# EAGLE design mote+cc3200 (EAGLE 9.6.2)

## Sheet 1 of 2
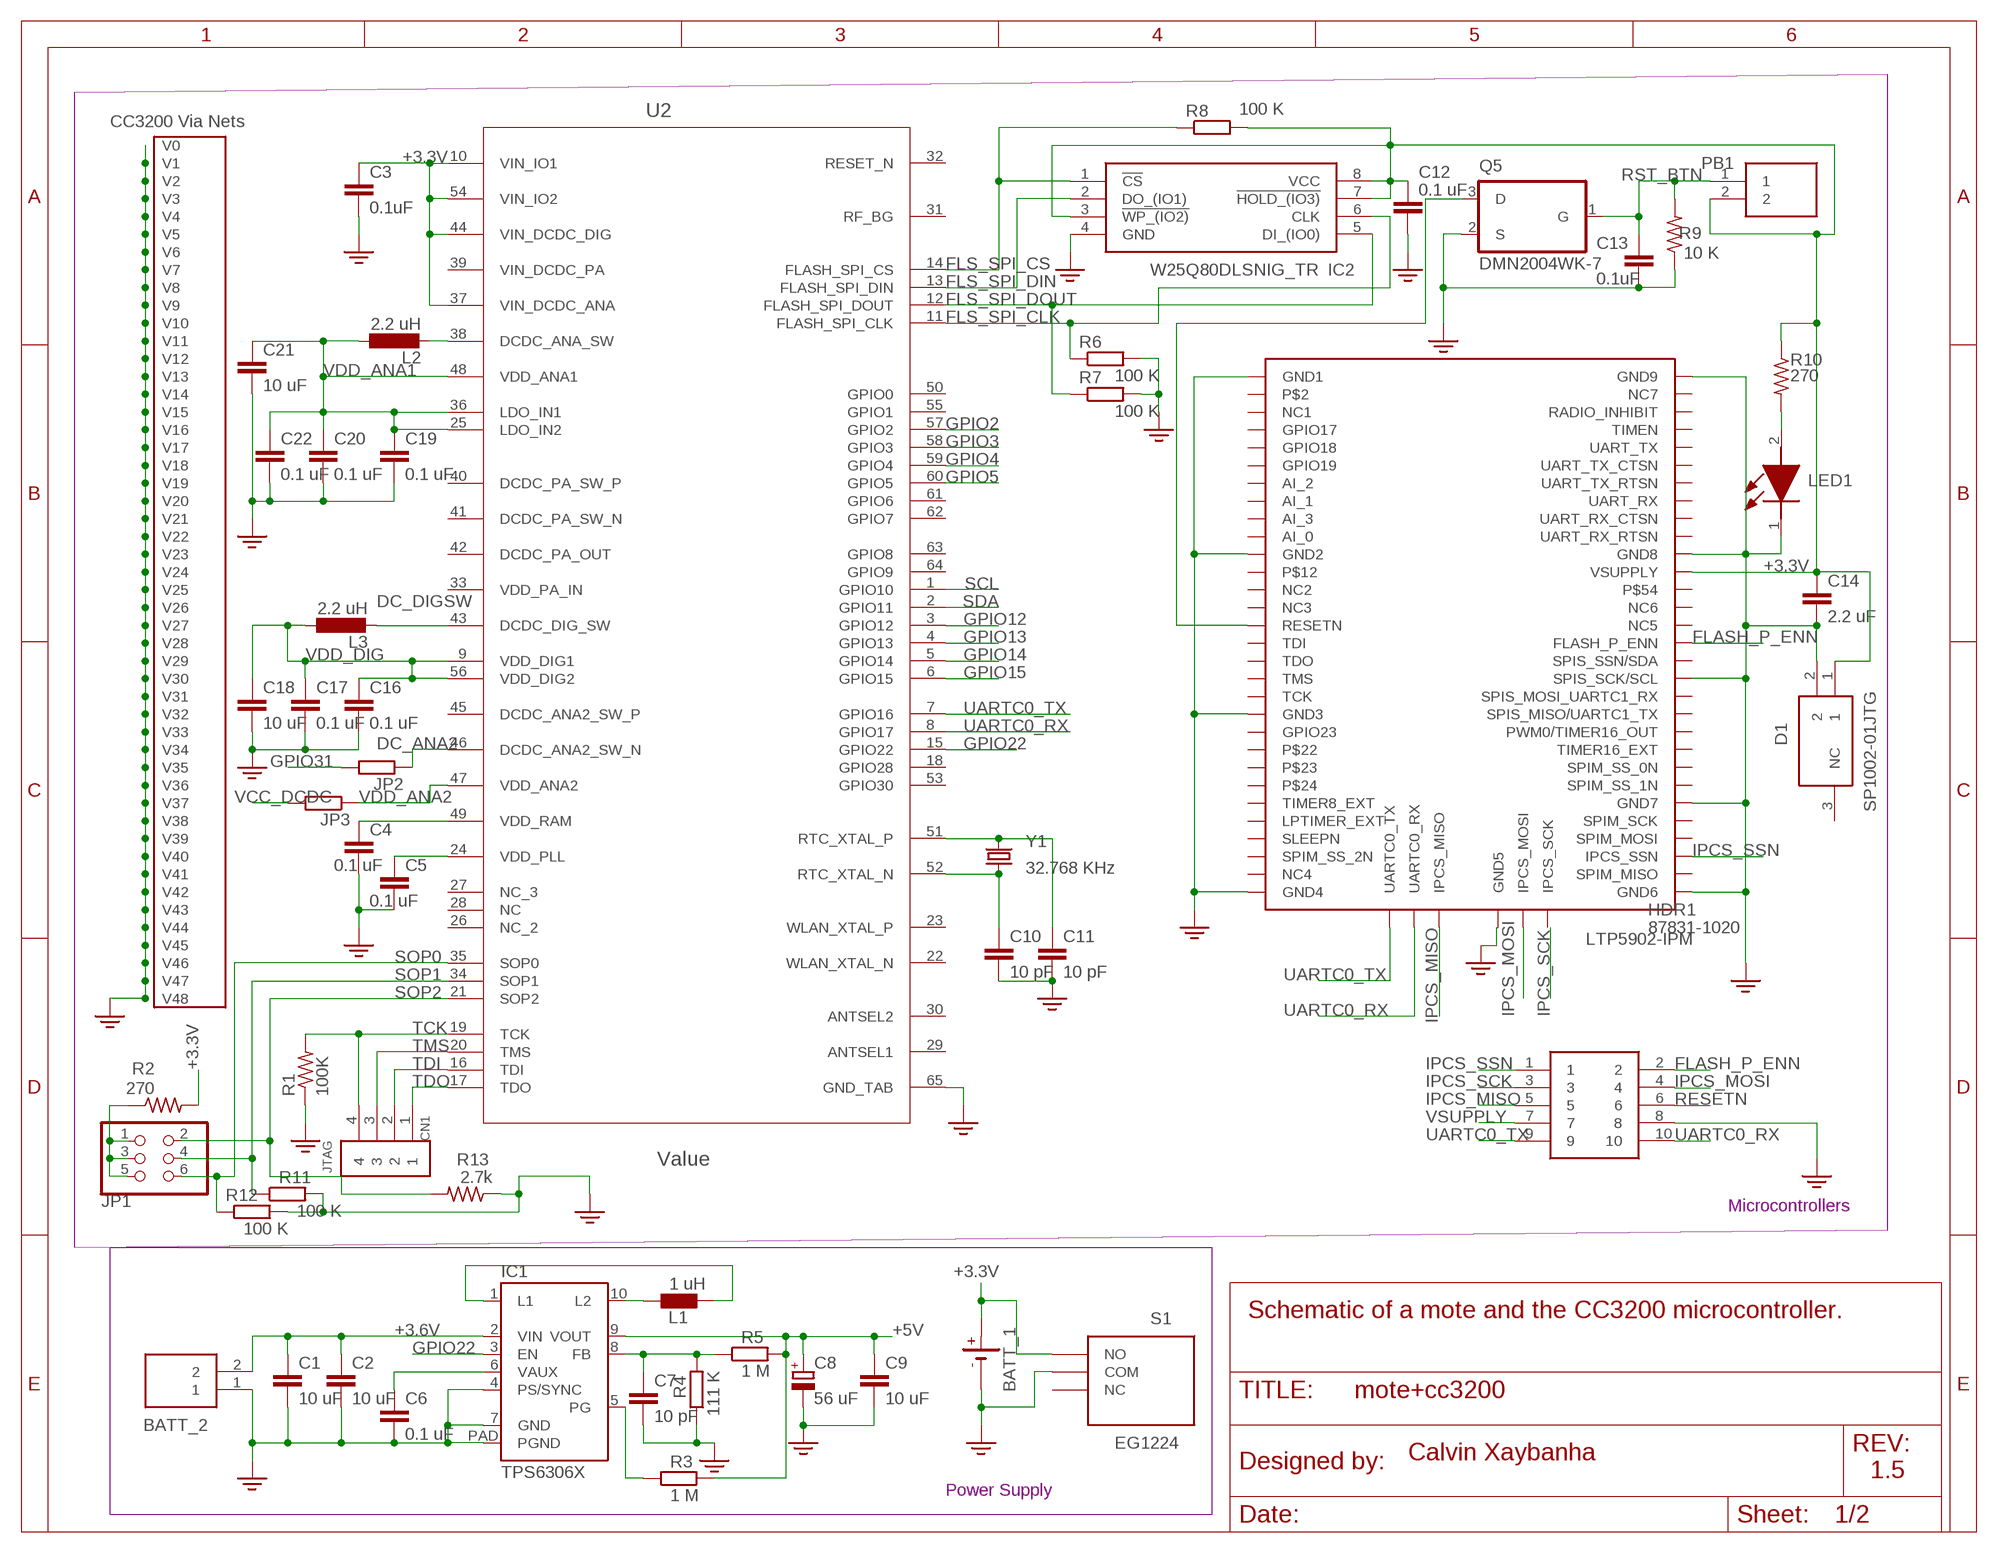
[diagram p0: schematic, sheet 1]
FRAME1 (FRAME_8.5X11): SPICEPREFIX: X

### Parts
BATT_1  BATTERY_BR1225/FA  [BATTERY_BR1225/FA]
BATT_2  12BH23P-GR  [12BH23PGR]
C1  10 uF  CC1808  [C1808]
C2  10 uF  CC1808  [C1808]
C3  0.1uF  C5/3.5  [C5B3.5]
C4  0.1 uF  C-EUC1808  [C1808]
C5  0.1 uF  C-EUC1808  [C1808]
C6  0.1 uF  C-EUC1808  [C1808]
C7  10 pF  CC1808  [C1808]
C8  56 uF  CPOL-EUE3.5-8  [E3,5-8]
C9  10 uF  CC1808  [C1808]
C10  10 pF  CC1808  [C1808]
C11  10 pF  CC1808  [C1808]
C12  0.1 uF  C-EUC1808  [C1808]
C13  0.1uF  C5/3.5  [C5B3.5]
C14  2.2 uF  CC1808  [C1808]
C16  0.1 uF  C-EUC1808  [C1808]
C17  0.1 uF  C-EUC1808  [C1808]
C18  10 uF  CC1808  [C1808]
C19  0.1 uF  C-EUC1808  [C1808]
C20  0.1 uF  C-EUC1808  [C1808]
C21  10 uF  CC1808  [C1808]
C22  0.1 uF  C-EUC1808  [C1808]
CN1  JTAG  1X4-BIG  [1X04-BIG]
D1  SP1002-01JTG  [SOT132P220X110-3N]
HDR1  87831-1020  [SHDR10W55P200_2X5_1265X630X640]
IC1  TPS6306X  [S-PWSON-N10]
IC2  W25Q80DLSNIG_TR  [SOIC127P600X175-8N]
JP1  PINHD-2X3/90  [2X03/90]
JP2  RR0201  [R0201]
JP3  RR0201  [R0201]
L1  1 uH  L0204/7  [0204/7]
L2  2.2 uH  L-EUL3216C  [L3216C]
L3  2.2 uH  L-EUL3216C  [L3216C]
LED1  156120RS75000  [LEDM3216X130N]
PB1  FSMSM  [FSMSM]
Q5  DMN2004WK-7  [SC70-3_DCK]
R1  100K  R-US_0207/10  [0207/10]
R2  270  WSLP1206R0500FEA  [RES_1206]
R3  1 M  R-EU_R5025  [R5025]
R4  111 K  R-EU_R1206  [R1206]
R5  1 M  R-EU_R5025  [R5025]
R6  100 K  R-EU_R1206  [R1206]
R7  100 K  R-EU_R1206  [R1206]
R8  100 K  R-EU_R1206  [R1206]
R9  10 K  WSLP1206R0500FEA  [RES_1206]
R10  270  WSLP1206R0500FEA  [RES_1206]
R11  100 K  R-EU_R1206  [R1206]
R12  100 K  R-EU_R1206  [R1206]
R13  2.7k  WSLP1206R0500FEA  [RES_1206]
S1  EG1224  [EG1224]
U2  Value  CC3200R1M2RGCR  [RGC0064A]
U3  LTP5902  [LTP5902-MMCX]
Y1  32.768 KHz  KX-13  [7.0X5.0]

### Nets
+3.3V [Power]: BATT_1.+ C3.1 C12.1 C14.1 D1.1 IC2.3(!WP_(IO2)) IC2.7(!HOLD_(IO3)) IC2.8(VCC) PB1.2 R2.2 R8.2 R10.1 S1.1(NO) U2.10(VIN_IO1) U2.37(VIN_DCDC_ANA) U2.44(VIN_DCDC_DIG) U2.54(VIN_IO2) U3.P55(VSUPPLY) ; also sheet 2
+3.6V [Power]: BATT_2.2 C1.1 C2.1 IC1.2(VIN)
+5V [Power]: C8.+ C9.1 IC1.9(VOUT) R3.2 R5.2 ; also sheet 2
DC_ANA2 [Signals]: JP2.1 U2.46(DCDC_ANA2_SW_N)
DC_DIGSW [Signals]: L3.2 U2.43(DCDC_DIG_SW)
FB_TPS [Signals]: C7.1 IC1.8(FB) R4.2 R5.1
FLASH_P_ENN [Signals]: HDR1.2 U3.P51(FLASH_P_ENN)
FLS_SPI_CLK [Signals]: IC2.6(CLK) R6.1 U2.11(FLASH_SPI_CLK)
FLS_SPI_CS [Signals]: IC2.1(!CS) R8.1 U2.14(FLASH_SPI_CS)
FLS_SPI_DIN [Signals]: IC2.2(DO_(IO1)) U2.13(FLASH_SPI_DIN)
FLS_SPI_DOUT [Signals]: IC2.5(DI_(IO0)) R7.1 U2.12(FLASH_SPI_DOUT)
GND: BATT_1.- BATT_2.1 C1.2 C2.2 C3.2 C4.2 C5.2 C6.2 C7.2 C8.- C9.2 C10.2 C11.2 C12.2 C13.1 C14.2 C16.2 C17.2 C18.2 C19.2 C20.2 C21.2 C22.2 D1.2 HDR1.8 IC1.4(PS/SYNC) IC1.7(GND) IC1.PAD(PGND) IC2.4(GND) LED1.1(K) Q5.2(S) R1.1 R4.1 R6.2 R7.2 R9.1 R11.2 R12.2 R13.1 S1.2(COM) U2.65(GND_TAB) U2.V(V0) U2.V_1(V1) U2.V_2(V2) U2.V_3(V3) U2.V_4(V4) U2.V_5(V5) U2.V_6(V6) U2.V_7(V7) U2.V_8(V8) U2.V_9(V9) U2.V_10(V10) U2.V_11(V11) U2.V_12(V12) U2.V_13(V13) U2.V_14(V14) U2.V_15(V15) U2.V_16(V16) U2.V_17(V17) U2.V_18(V18) U2.V_19(V19) U2.V_20(V20) U2.V_21(V21) U2.V_22(V22) U2.V_23(V23) U2.V_24(V24) U2.V_25(V25) U2.V_26(V26) U2.V_27(V27) U2.V_28(V28) U2.V_29(V29) U2.V_30(V30) U2.V_31(V31) U2.V_32(V32) U2.V_33(V33) U2.V_34(V34) U2.V_35(V35) U2.V_36(V36) U2.V_37(V37) U2.V_38(V38) U2.V_39(V39) U2.V_40(V40) U2.V_41(V41) U2.V_42(V42) U2.V_43(V43) U2.V_44(V44) U2.V_45(V45) U2.V_46(V46) U2.V_47(V47) U2.V_48(V48) U3.P1(GND1) U3.P11(GND2) U3.P20(GND3) U3.P30(GND4) U3.P34(GND5) U3.P37(GND6) U3.P42(GND7) U3.P49(SPIS_SCK/SCL) U3.P56(GND8) U3.P66(GND9) ; supply symbol labelled GND2 ; also sheet 2
GPIO2 [Signals]: U2.57(GPIO2) ; also sheet 2
GPIO3 [Signals]: U2.58(GPIO3) ; also sheet 2
GPIO4 [Signals]: U2.59(GPIO4) ; also sheet 2
GPIO5 [Signals]: U2.60(GPIO5) ; also sheet 2
GPIO12 [Signals]: U2.3(GPIO12) ; also sheet 2
GPIO13 [Signals]: U2.4(GPIO13) ; also sheet 2
GPIO14 [Signals]: U2.5(GPIO14) ; also sheet 2
GPIO15 [Signals]: U2.6(GPIO15) ; also sheet 2
GPIO22 [Signals]: IC1.3(EN) U2.15(GPIO22)
GPIO31 [Signals]: JP2.2
IPCS_MISO [Signals]: HDR1.5 U3.P33(IPCS_MISO)
IPCS_MOSI [Signals]: U3.P35(IPCS_MOSI)
IPCS_SCK [Signals]: HDR1.3
IPCS_SSN [Signals]: HDR1.1 U3.P39(IPCS_SSN)
JP1_PWR: JP1.1 JP1.3 JP1.5 R2.1
L2_ANA [Signals]: L2.2 U2.38(DCDC_ANA_SW)
L_TPS1 [Signals]: IC1.1(L1) L1.2
L_TPS2 [Signals]: IC1.10(L2) L1.1
LED1 [Signals]: LED1.2(A) R10.2
PG_TPS [Signals]: IC1.5(PG) R3.1
RESETN [Signals]: HDR1.6 Q5.3(D) U3.P15(RESETN)
RST_BTN [Signals]: C13.2 PB1.1 Q5.1(G) R9.2
SCL [Signals]: U2.1(GPIO10) ; also sheet 2
SDA [Signals]: U2.2(GPIO11) ; also sheet 2
SOP0 [Signals]: JP1.6 R12.1 U2.35(SOP0)
SOP1 [Signals]: JP1.4 R11.1 U2.34(SOP1)
SOP2 [Signals]: JP1.2 R13.2 U2.21(SOP2)
TCK [Signals]: CN1.4 R1.2 U2.19(TCK)
TDI [Signals]: CN1.2 U2.16(TDI)
TDO [Signals]: CN1.1 U2.17(TDO)
TMS [Signals]: CN1.3 U2.20(TMS)
UARTC0_RX [Signals]: HDR1.10 U2.8(GPIO17) U3.P32(UARTC0_RX)
UARTC0_TX [Signals]: HDR1.9 U2.7(GPIO16) U3.P31(UARTC0_TX)
VAUX_TPS [Signals]: C6.1 IC1.6(VAUX)
VCC_DCDC [Signals]: JP3.2
VDD_ANA1 [Signals]: C19.1 C20.1 C21.1 C22.1 L2.1 U2.25(LDO_IN2) U2.36(LDO_IN1) U2.48(VDD_ANA1)
VDD_ANA2 [Signals]: JP3.1 U2.47(VDD_ANA2)
VDD_DIG: C16.1 C17.1 C18.1 L3.1 U2.9(VDD_DIG1) U2.56(VDD_DIG2)
VDD_PULL [Signals]: C5.1 U2.24(VDD_PLL)
VDD_RAM [Signals]: C4.1 U2.49(VDD_RAM)
VSUPPLY: HDR1.7
XTAL1 [Signals]: C11.1 U2.51(RTC_XTAL_P) Y1.3
XTAL2 [Signals]: C10.1 U2.52(RTC_XTAL_N) Y1.1
Unconnected: D1.3(NC) HDR1.4 S1.3(NC) S1.MH1 S1.MH2 S1.MH3 S1.MH4 U2.18(GPIO28) U2.22(WLAN_XTAL_N) U2.23(WLAN_XTAL_P) U2.26(NC_2) U2.27(NC_3) U2.28(NC) U2.29(ANTSEL1) U2.30(ANTSEL2) U2.31(RF_BG) U2.32(RESET_N) U2.45(DCDC_ANA2_SW_P) U2.50(GPIO0) U2.53(GPIO30) U2.55(GPIO1) U2.61(GPIO6) U2.62(GPIO7) U2.63(GPIO8) U2.64(GPIO9) U3.P2 U3.P3(NC1) U3.P4(GPIO17) U3.P5(GPIO18) U3.P6(GPIO19) U3.P7(AI_2) U3.P8(AI_1) U3.P9(AI_3) U3.P10(AI_0) U3.P12 U3.P13(NC2) U3.P14(NC3) U3.P16(TDI) U3.P17(TDO) U3.P18(TMS) U3.P19(TCK) U3.P21(GPIO23) U3.P22 U3.P23 U3.P24 U3.P25(TIMER8_EXT) U3.P26(LPTIMER_EXT) U3.P27(SLEEPN) U3.P28(SPIM_SS_2N) U3.P29(NC4) U3.P36(IPCS_SCK) U3.P38(SPIM_MISO) U3.P40(SPIM_MOSI) U3.P41(SPIM_SCK) U3.P43(SPIM_SS_1N) U3.P44(SPIM_SS_0N) U3.P45(TIMER16_EXT) U3.P46(PWM0/TIMER16_OUT) U3.P47(SPIS_MISO/UARTC1_TX) U3.P48(SPIS_MOSI_UARTC1_RX) U3.P50(SPIS_SSN/SDA) U3.P52(NC5) U3.P53(NC6) U3.P54 U3.P57(UART_RX_RTSN) U3.P58(UART_RX_CTSN) U3.P59(UART_RX) U3.P60(UART_TX_RTSN) U3.P61(UART_TX_CTSN) U3.P62(UART_TX) U3.P63(TIMEN) U3.P64(RADIO_INHIBIT) U3.P65(NC7)

### Notes on the sheet
- CC3200 Via Nets
- LTP5902-IPM
- Microcontrollers
- Schematic of a mote and the CC3200 microcontroller.
- Calvin Xaybanha
- 1.5
- Power Supply

## Sheet 2 of 2
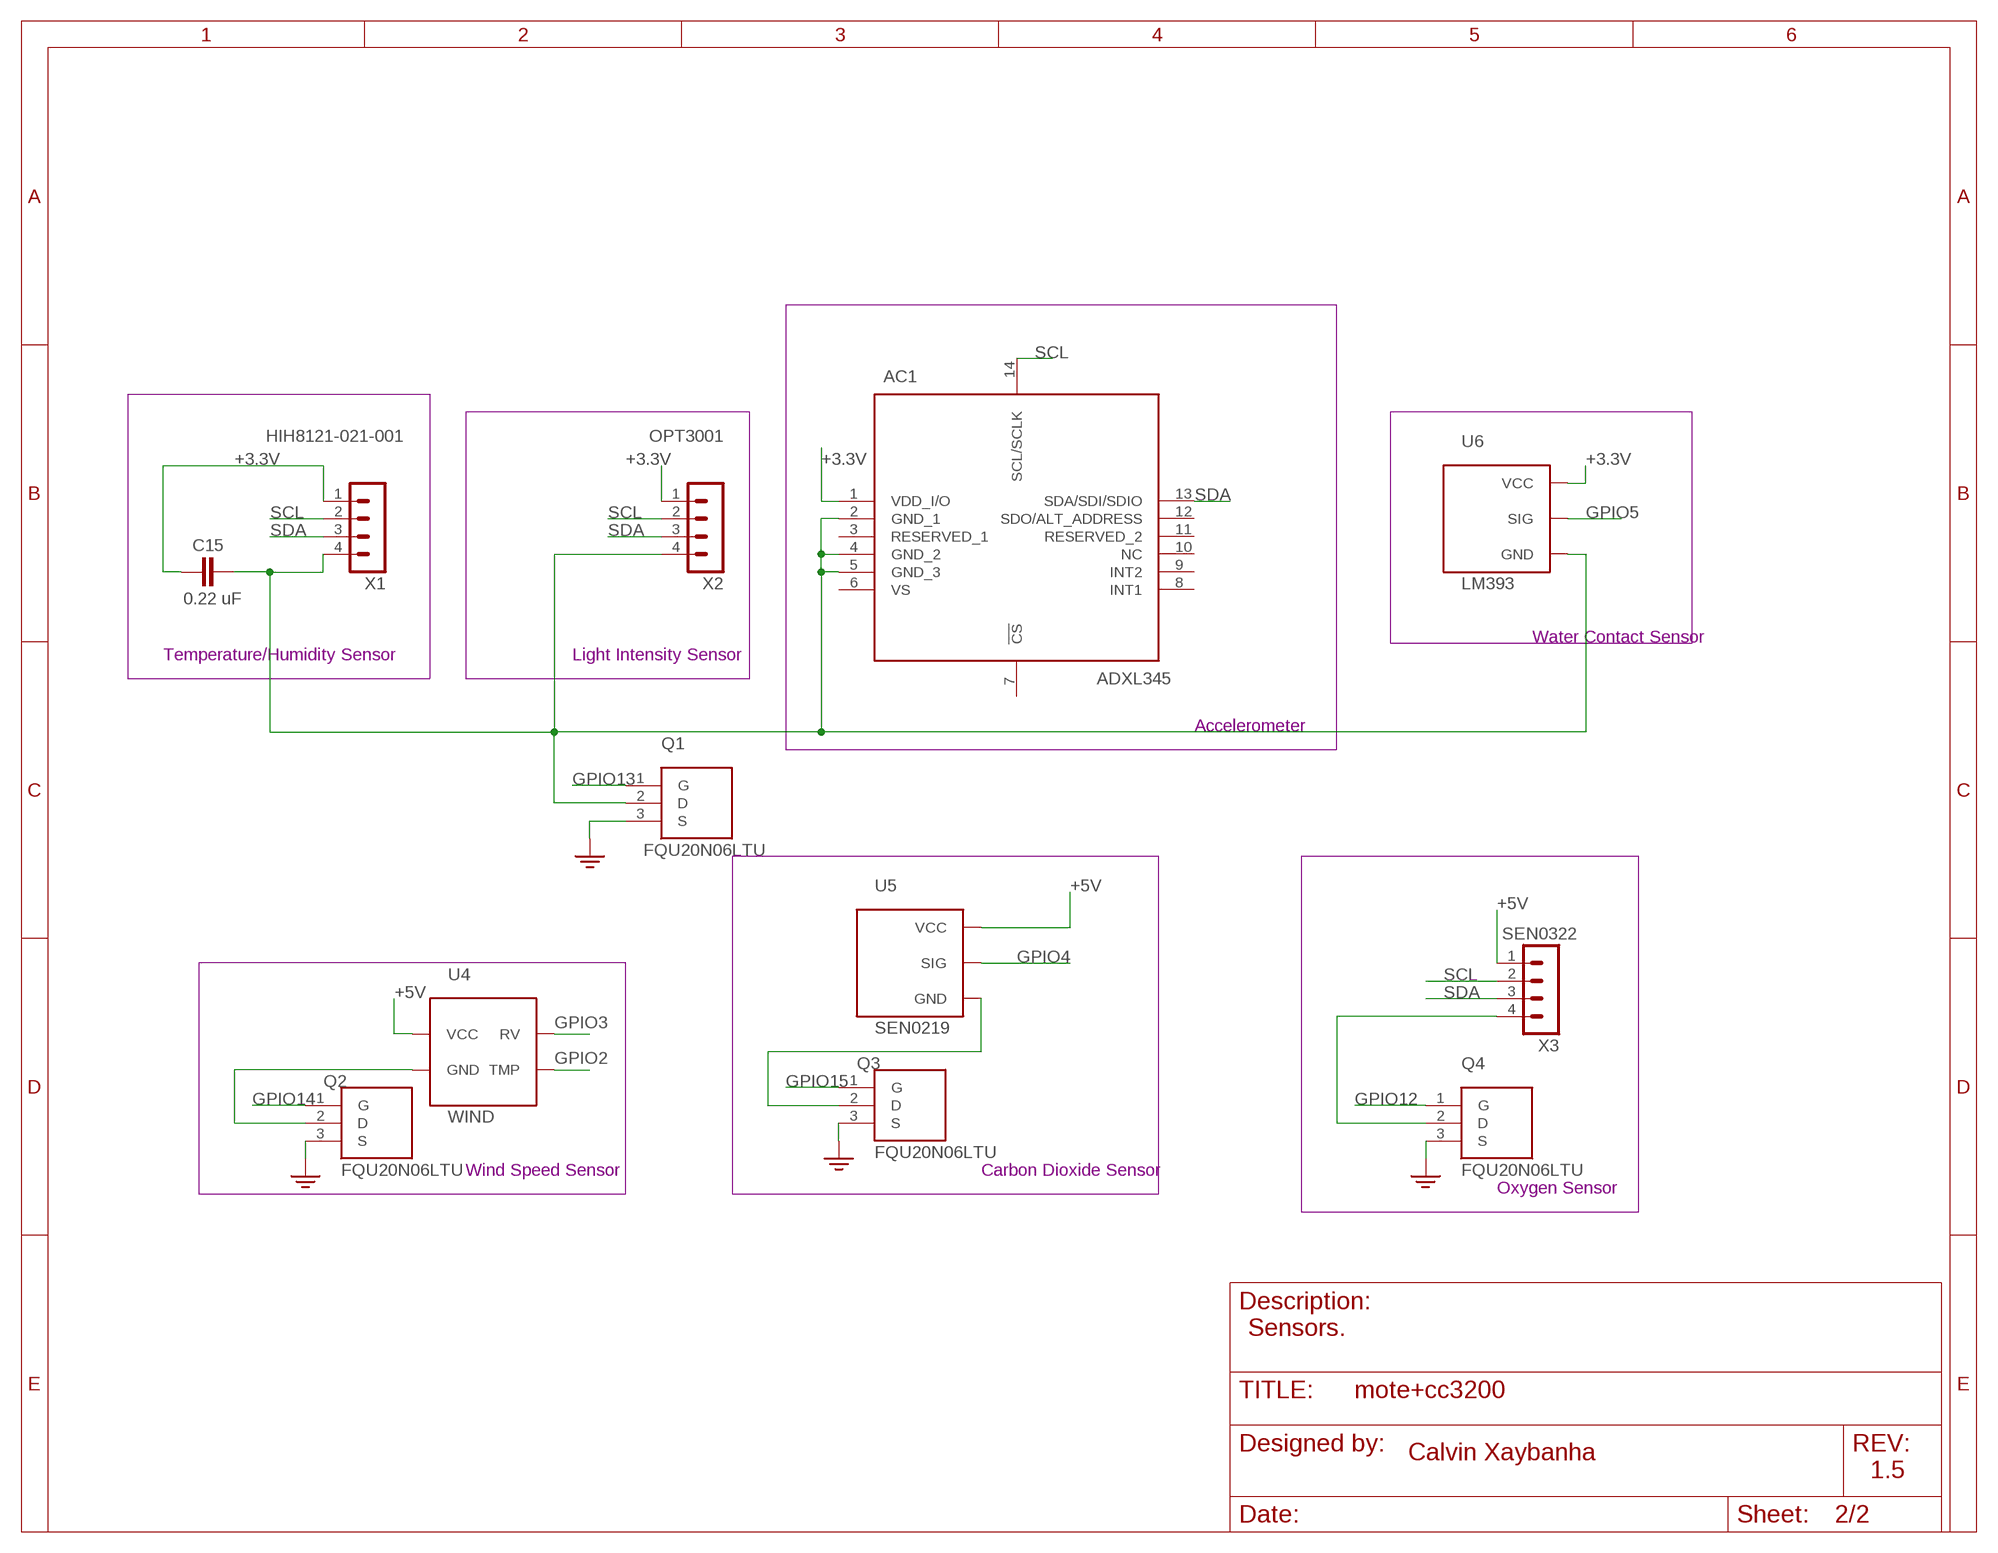
[diagram p1: schematic, sheet 2]

### Parts
AC1  ADXL345  [CC-14-1]
C15  0.22 uF  C5/3.5  [C5B3.5]
Q1  FQU20N06LTU  [TO229P250X658X985-3P]
Q2  FQU20N06LTU  [TO229P250X658X985-3P]
Q3  FQU20N06LTU  [TO229P250X658X985-3P]
Q4  FQU20N06LTU  [TO229P250X658X985-3P]
U4  WIND  [WIND]
U5  SEN0219  [SEN0219]
U6  LM393  [LM393]
X1  HIH8121-021-001  B4B-PH-K-S  [B4B-PH-K-S]
X2  OPT3001  B4B-PH-K-S  [B4B-PH-K-S]
X3  SEN0322  B4B-PH-K-S  [B4B-PH-K-S]

### Nets
+3.3V [Power]: AC1.1(VDD_I/O) C15.1 U6.P$1(VCC) X1.1 X2.1 ; also sheet 1
+5V [Power]: U4.P$1(VCC) U5.P$1(VCC) X3.1 ; also sheet 1
GND: Q1.3(S) Q2.3(S) Q3.3(S) Q4.3(S) ; supply symbol labelled GND2 ; also sheet 1
GPIO2 [Signals]: U4.P$4(TMP) ; also sheet 1
GPIO3 [Signals]: U4.P$3(RV) ; also sheet 1
GPIO4 [Signals]: U5.P$2(SIG) ; also sheet 1
GPIO5 [Signals]: U6.P$2(SIG) ; also sheet 1
GPIO12 [Signals]: Q4.1(G) ; also sheet 1
GPIO13 [Signals]: Q1.1(G) ; also sheet 1
GPIO14 [Signals]: Q2.1(G) ; also sheet 1
GPIO15 [Signals]: Q3.1(G) ; also sheet 1
Q1+ [Signals]: AC1.2(GND_1) AC1.4(GND_2) AC1.5(GND_3) C15.2 Q1.2(D) U6.P$3(GND) X1.4 X2.4
Q2+ [Signals]: Q2.2(D) U4.P$2(GND)
Q3+ [Signals]: Q3.2(D) U5.P$3(GND)
Q4+ [Signals]: Q4.2(D) X3.4
SCL [Signals]: AC1.14(SCL/SCLK) X1.2 X2.2 X3.2 ; also sheet 1
SDA [Signals]: AC1.13(SDA/SDI/SDIO) X1.3 X2.3 X3.3 ; also sheet 1
Unconnected: AC1.3(RESERVED_1) AC1.6(VS) AC1.7(!CS) AC1.8(INT1) AC1.9(INT2) AC1.10(NC) AC1.11(RESERVED_2) AC1.12(SDO/ALT_ADDRESS)

### Notes on the sheet
- Water Contact Sensor
- Temperature/Humidity Sensor | Light Intensity Sensor
- Accelerometer
- Wind Speed Sensor | Carbon Dioxide Sensor
- Oxygen Sensor
- Sensors.
- Calvin Xaybanha
- 1.5

## Power pins joined to a net without a drawn wire
DCDC_PA_OUT: U2.42(DCDC_PA_OUT)
DCDC_PA_SW_N: U2.41(DCDC_PA_SW_N)
DCDC_PA_SW_P: U2.40(DCDC_PA_SW_P)
VDD_PA_IN: U2.33(VDD_PA_IN)
VIN_DCDC_PA: U2.39(VIN_DCDC_PA)

## Library data of the parts
AC1 = ADXL345:ADXL345: 3-Axis Accelerometer IC Source: Datasheet <http://www.analog.com/media/en/technical-documentation/data-sheets/ADXL345.pdf>; DESCRIPTION: 3-Axis Accelerometer IC; HEIGHT: mm; MANUFACTURER_NAME: Analog Devices; MANUFACTURER_PART_NUMBER: ADXL345; MOUSER_PART_NUMBER: N/A; MOUSER_PRICE-STOCK: https://www.mouser.co.uk/ProductDetail/Analog-Devices/ADXL345?qs=5aG0NVq1C4y%252BItyqaAF9pQ%3D%3D
BATT_1 = 52101-101-REV-A_v16:BATTERY_BR1225/FA: BATT LITH COIN 3V
BATT_2 = SamacSys_Parts:12BH23P-GR: Cylindrical Battery Contacts, Clips, Holders & Springs CR123A HOLDER Source: Datasheet <https://www.mouser.co.uk/datasheet/2/209/Eagle_032917_12BH23P-GR_EPD-200981-1171083.pdf>; DESCRIPTION: Cylindrical Battery Contacts, Clips, Holders & Springs CR123A HOLDER; HEIGHT: 15.6mm; MANUFACTURER_NAME: Eagle Plastic Devices; MANUFACTURER_PART_NUMBER: 12BH23P-GR; MOUSER_PART_NUMBER: 12BH23P-GR; MOUSER_PRICE-STOCK: https://www.mouser.co.uk/ProductDetail/Eagle-Plastic-Devices/12BH23P-GR/?qs=AQlKX63v8RtoPEbnxYQ6dg%3D%3D
C1 C2 C7 C9-C11 C14 C18 C21 = eagle-ltspice:C: CAPACITOR, European symbol; SPICEMODEL: NONE; SPICEPREFIX: C
C3 C13 C15 = capacitor-wima:C: CAPACITOR naming: grid - package width
C4-C6 C12 C16 C17 C19 C20 C22 = rcl:C-EU: CAPACITOR, European symbol; SPICEPREFIX: C
C8 = rcl:CPOL-EU: POLARIZED CAPACITOR, European symbol; SPICEPREFIX: C
CN1 = adafruit:1X4: 4-pin connector
D1 = SamacSys_Parts:SP1002-01JTG: Littelfuse SP1002-01JTG, Dual-Element Bi-Directional TVS Diode Array, 3-Pin SC-70 Source: Datasheet <https://www.littelfuse.com/~/media/electronics/datasheets/tvs_diode_arrays/littelfuse_tvs_diode_array_sp1002_datasheet.pdf.pdf>; DESCRIPTION: Littelfuse SP1002-01JTG, Dual-Element Bi-Directional TVS Diode Array, 3-Pin SC-70; HEIGHT: 1.1mm; MANUFACTURER_NAME: LITTELFUSE; MANUFACTURER_PART_NUMBER: SP1002-01JTG; MOUSER_PART_NUMBER: 576-SP1002-01JTG; MOUSER_PRICE-STOCK: https://www.mouser.co.uk/ProductDetail/Littelfuse/SP1002-01JTG?qs=Xb8IjHhkxj6pIS6%252BgvMqKQ%3D%3D
HDR1 = SamacSys_Parts:87831-1020: Header 2.00mm Milli-Grid, vert, TH, 10w Molex MILLI-GRID Series, Series Number 87831, 2mm Pitch 10 Way 2 Row Straight PCB Header, Solder Termination, 2A Source: Datasheet; DESCRIPTION: Header 2.00mm Milli-Grid, vert, TH, 10w Molex MILLI-GRID Series, Series Number 87831, 2mm Pitch 10 Way 2 Row Straight PCB Header, Solder Termination, 2A; HEIGHT: 6.4mm; MANUFACTURER_NAME: Molex; MANUFACTURER_PART_NUMBER: 87831-1020; MOUSER_PART_NUMBER: 538-87831-1020; MOUSER_PRICE-STOCK: https://www.mouser.co.uk/ProductDetail/Molex/87831-1020?qs=8PELaTI4Pt8k%2F%2FV9vKeYIg%3D%3D
IC1 = m_vreg:TPS6306X: TPS6306x High Input Voltage, Buck-Boost Converter With 2-A Switch Current Features Input Voltage Range: 2.5 V to 12 V Efficiency: Up to 93% Output Current at 5 V (VIN<10 V): 2 A in Buck Mode Output Current at 5 V (VIN>4 V): 1.3 A in Boost Mode Automatic Transition Between Step Down and Boost Mode Typical Device Quiescent Current: < 30 μA Fixed and Adjustable Output Voltage Options from 2.5 V to 8 V Power-Save Mode for Improved Efficiency at Low Output Power Forced Fixed-Frequency Operation at 2.4 MHz and Synchronization Possible Power Good Output Buck-Boost Overlap ControlTM Load Disconnect During Shutdown Overtemperature Protection Overvoltage Protection Description The TPS6306x devices provide a power supply solution for products powered by either three-cell up to six-cell alkaline, NiCd or NiMH battery, or a one- cell or dual-cell Li-Ion or Li-polymer battery. Output currents can go as high as 2-A while using a dual-cell Li-Ion or Li-polymer battery, and discharge it down to 5 V or lower. The buck-boost converter is based on a fixed frequency, pulse-width-modulation (PWM) controller using synchronous rectification to obtain maximum efficiency. At low load currents, the converter enters power-save mode to maintain high efficiency over a wide load current range. The power- save mode can be disabled, forcing the converter to operate at a fixed switching frequency. The maximum average current in the switches is limited to a typical value of 2.25 A. The output voltage is programmable using an external resistor divider, or is fixed internally on the chip. The converter can be disabled to minimize battery drain. During shutdown, the load is disconnected from the battery. The devices are available in a 3 mm × 3 mm, 10-pin, WSON (DSC), PowerPADTM package. Information based on TI document SLVSA92B – DECEMBER 2011 – REVISED DECEMBER 2014 Added 2016-07-24; MANUF: TI; PARTNUM: TPS6306X
IC2 = SamacSys_Parts:W25Q80DLSNIG_TR: 2.5V AND 3V 8M-BIT SERIAL FLASH MEMORY WITH DUAL AND QUAD SPI Source: Datasheet <https://www.winbond.com/resource-files/w25q80dv dl_revh_10022015.pdf>; DESCRIPTION: 2.5V AND 3V 8M-BIT SERIAL FLASH MEMORY WITH DUAL AND QUAD SPI; HEIGHT: 1.75mm; MANUFACTURER_NAME: Winbond; MANUFACTURER_PART_NUMBER: W25Q80DLSNIG TR; MOUSER_PART_NUMBER: 454-W25Q80DLSNIGTR; MOUSER_PRICE-STOCK: https://www.mouser.co.uk/ProductDetail/Winbond/W25Q80DLSNIG-TR?qs=qSfuJ%252Bfl%2Fd4EQ3sPamYlCg%3D%3D
JP1 = pinhead:PINHD-2X3: PIN HEADER
JP2 JP3 = eagle-ltspice:R: RESISTOR, European symbol; SPICEMODEL: NONE; SPICEPREFIX: R
L1 = eagle-ltspice:L: INDUCTOR, European symbol; SPICEMODEL: NONE; SPICEPREFIX: L
L2 L3 = rcl:L-EU: INDUCTOR, European symbol; SPICEPREFIX: L
LED1 = SamacSys_Parts:156120RS75000: Wurth Elektronik 156120RS75000, WL-SMRW Series Red LED, 624 nm, 3216 (1206) Clear, Rectangle Lens SMD Package Source: Datasheet <https://katalog.we-online.com/led/datasheet/156120RS75000.pdf>; DESCRIPTION: Wurth Elektronik 156120RS75000, WL-SMRW Series Red LED, 624 nm, 3216 (1206) Clear, Rectangle Lens SMD Package; HEIGHT: 1.3mm; MANUFACTURER_NAME: Wurth Elektronik; MANUFACTURER_PART_NUMBER: 156120RS75000; MOUSER_PART_NUMBER: 710-156120RS75000; MOUSER_PRICE-STOCK: https://www.mouser.co.uk/ProductDetail/Wurth-Elektronik/156120RS75000?qs=2kOmHSv6VfTlw4DhG%252BTIQw%3D%3D
PB1 = SamacSys_Parts:FSMSM: Tactile switch,SMT,SPST,rect black act Black Button Tactile Switch, SPST 50 mA@ 24 V dc 1.07mm Source: Datasheet; DESCRIPTION: Tactile switch,SMT,SPST,rect black act Black Button Tactile Switch, SPST 50 mA@ 24 V dc 1.07mm; HEIGHT: mm; MANUFACTURER_NAME: TE Connectivity; MANUFACTURER_PART_NUMBER: FSMSM; MOUSER_PART_NUMBER: 506-FSMSM; MOUSER_PRICE-STOCK: https://www.mouser.co.uk/ProductDetail/TE-Connectivity-Alcoswitch/FSMSM?qs=UhRTNahLC3yPLf3YjzjKAA%3D%3D
Q1-Q4 = SamacSys_Parts:FQU20N06LTU: Trans MOSFET N-CH 60V 17.2A 3-Pin IPAK Source: Datasheet <https://www.fairchildsemi.com/datasheets/FQ/FQU20N06L.pdf>; DESCRIPTION: Trans MOSFET N-CH 60V 17.2A 3-Pin IPAK; HEIGHT: 2.5mm; MANUFACTURER_NAME: ON Semiconductor; MANUFACTURER_PART_NUMBER: FQU20N06LTU; MOUSER_PART_NUMBER: 512-FQU20N06LTU; MOUSER_PRICE-STOCK: https://www.mouser.co.uk/ProductDetail/ON-Semiconductor-Fairchild/FQU20N06LTU?qs=bfRUmXT2lZisvT2ROxlO3Q%3D%3D
Q5 = SamacSys_Parts:DMN2004WK-7
R1 = resistor:R-US_: RESISTOR, American symbol
R2 R9 R10 R13 = Resistor_Capacitor:WSLP1206R0500FEA: RES 0.05 OHM 1% 1W 1206 Manufacturer's datasheet <http://www.vishay.com/docs/30122/wslp.pdf>; CREATED_BY: PCBLayout.com; DIGIKEY_PART_NUMBER: WSLP-.05TR-ND; MANUFACTURER: Vishay Dale; MPN: WSLP1206R0500FEA; PACKAGE: SMD 1206
R3-R8 R11 R12 = rcl:R-EU_: RESISTOR, European symbol; SPICEPREFIX: R
S1 = SamacSys_Parts:EG1224: E-SWITCH - EG1224 - SWITCH, SLIDE, SPDT, 500mA, 15V, PCB Source: Datasheet; DESCRIPTION: E-SWITCH - EG1224 - SWITCH, SLIDE, SPDT, 500mA, 15V, PCB; HEIGHT: 8.5mm; MANUFACTURER_NAME: E-Switch; MANUFACTURER_PART_NUMBER: EG1224; MOUSER_PART_NUMBER: 612-EG1224; MOUSER_PRICE-STOCK: https://www.mouser.co.uk/ProductDetail/E-Switch/EG1224/?qs=HKd%2Fp3M7KlUMARNITVNimA%3D%3D
U2 = CC3200:CC3200R1M2RGCR; ALTERNATEPARTNUMBER: CC3200R1M2RGC; COMPTYPE: IC; MANUFACTURER: Texas Instruments; MOUNTTYPE: SMT; PACKAGEREFERENCE: RGC0064A; PARTNUMBER: CC3200R1M2RGCR; PIN_COUNT: 65; REFDES: RefDes; ROHS: Y; TYPE: TYPE
U3 = LTP5902c:LTP5902
U4 = WINDc:WIND
U5 = SEN0219c:SEN0219
U6 = LM393c:LM393
X1-X3 = con-JST PH:B4B-PH: JST PH series header 2.00mm pitch disconnectable crimp style connectors, vertical (side entry type), 4 pins
Y1 = crystal-geyer_V1_0:KX: Quartz Crystals (MHz) SMD: KX - Serie Model Size l/w/h [mm] Frequency Range Frequency Stability Temp. Range [°C] Load Capacitance AECQ 200 availabel Datasheet KX-4 KX-5 KX-6 KX-7 KX-9A KX-9B KX-12A KX-12B KX-13 KX-20 KX-K KX-KS 1.6/1.2/0.3 2.0/1.6/0.45 2.5/2.0/0.55 3.2/2.5/0.8 5.0/3.2/1.0 5.0/3.2/1.1 6.0/3.5/1.1 6.0/3.5/1.0 7.0/5.0 /1.3 11.6/5.5/1.6 12.3/4.5/4.2 12.3/4.5/3.2 24.0 ~ 80.0 MHz 16.0 ~ 80.0 MHz 12.0 ~ 80.0 MHz 8.0 ~ 60.0 MHz 7,68 ~ 300,0 MHz 8,0 ~ 50,0 MHz 8,0 ~ 150,0 MHz 8,0 ~ 50,0 MHz 6,0 ~ 160,0 MHz 3,579 ~ 25,0 MHz 3,579 ~ 70,0 MHz 3,579 ~ 70,0 MHz ±10 … ±50ppm ±10 … ±50ppm ±10 … ±50ppm ±10 … ±50ppm ±10 … ±50ppm ±10 … ±50ppm ±10 … ±50ppm ±10 … ±50ppm ±10 … ±50ppm ±50ppm ±10 … ±50ppm ±10 … ±50ppm (*) -40°C …+85°C (*) -40°C …+125°C (*) -40°C …+125°C (*) -40°C …+125°C (*) -40°C …+105°C (*) -40°C …+105°C (*) -40°C …+125°C (*) -40°C …+105°C (*) -40°C …+105°C (*) -40°C …+105°C (*) -40°C …+85°C (*) -40°C …+85°C 8, 8…16 8, 8…16 10, 8…16 12, 7…20 16, 10…20 16, 10…20 16, 10…20 16, 12…20 16, 12…20 16, 12…20 16, 12…30 16, 12…30 - yes yes yes - - - - - - - - KX-4.pdf <http://www.geyer-electronic.de/uploads/tx_userartikelfrequenz/GEYER-KX-4.pdf> KX-5.pdf <http://www.geyer-electronic.de/uploads/tx_userartikelfrequenz/GEYER-KX-5.pdf> KX-6.pdf <http://www.geyer-electronic.de/uploads/tx_userartikelfrequenz/GEYER-KX-6.pdf> KX-7.pdf <http://www.geyer-electronic.de/uploads/tx_userartikelfrequenz/GEYER-KX-7.pdf> KX-9A.pdf <http://www.geyer-electronic.de/uploads/tx_userartikelfrequenz/GEYER-KX-9A.pdf> KX-9B.pdf <http://www.geyer-electronic.de/uploads/tx_userartikelfrequenz/GEYER-KX-9B.pdf> KX-12A.pdf <http://www.geyer-electronic.de/uploads/tx_userartikelfrequenz/GEYER-KX-12A.pdf> KX-12B.pdf <http://www.geyer-electronic.de/uploads/tx_userartikelfrequenz/GEYER-KX-12B.pdf> KX-13.pdf <http://www.geyer-electronic.de/uploads/tx_userartikelfrequenz/GEYER-KX-13.pdf> KX-20.pdf <http://www.geyer-electronic.de/uploads/tx_userartikelfrequenz/GEYER-KX-20.pdf> KX-K.pdf <http://www.geyer-electronic.de/uploads/tx_userartikelfrequenz/GEYER-KX-K.pdf> KX-KS.pdf <http://www.geyer-electronic.de/uploads/tx_userartikelfrequenz/GEYER-KX-KS.pdf> <http://www.geyer-electronic.de/fileadmin/template/img/logo-geyer-electronic.png> Details see: http://www.geyer-electronic.de/Frequenz-Produkte.9.0.html Created 2016-06-07, Hans Locher 2016 (C) Geyer Quartz Technology KX4,KX5,KX6,KX7,KX9A,KX9B,KX12A,KX12B,KX13,KX20,KXK,KXKS;1612;2016;2520;3225;5032;6035;7050;11655;12345;1,6x1,2;2,0x1,6;2,5x2,0;3,2x2,5;5,0x3,2;6,0x3,5;7,0x5,0;11,6x5,5;12,3x4,5;12,3x4,5;1.6x1.2;2.0x1.6;2.5x2.0;3.2x2.5;5.0x3.2;6.0x3.5;7.0x5.0;11.6x5.5;12.3x4.5;12.3x4.5;

## Board
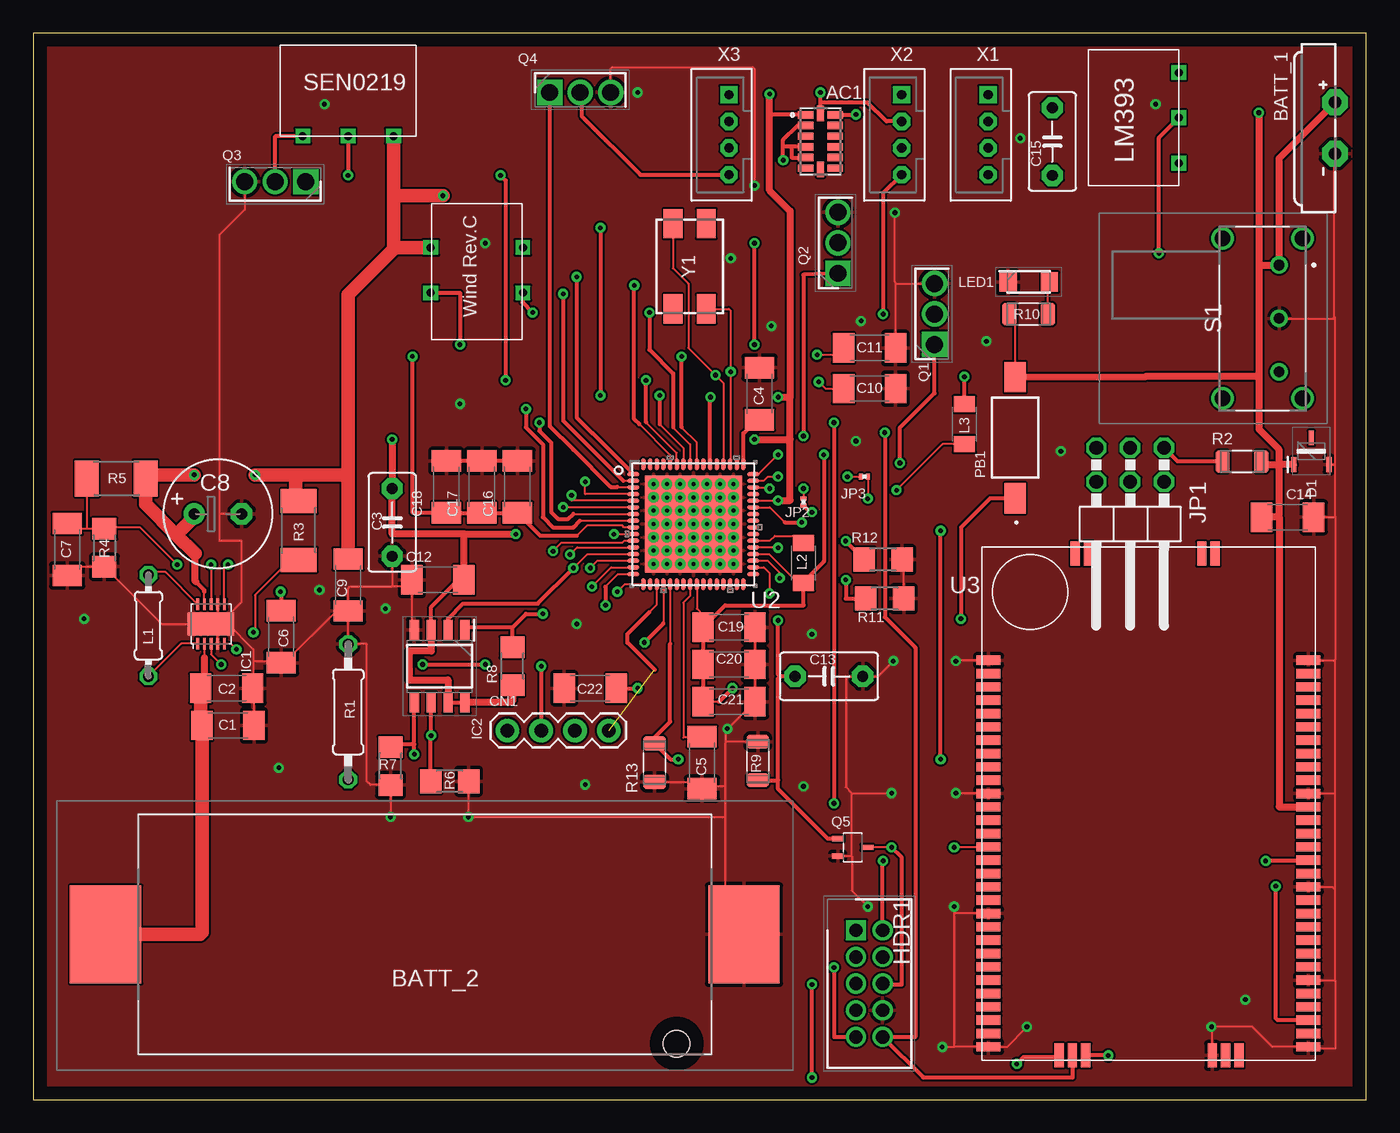
[diagram p2: board, top side]
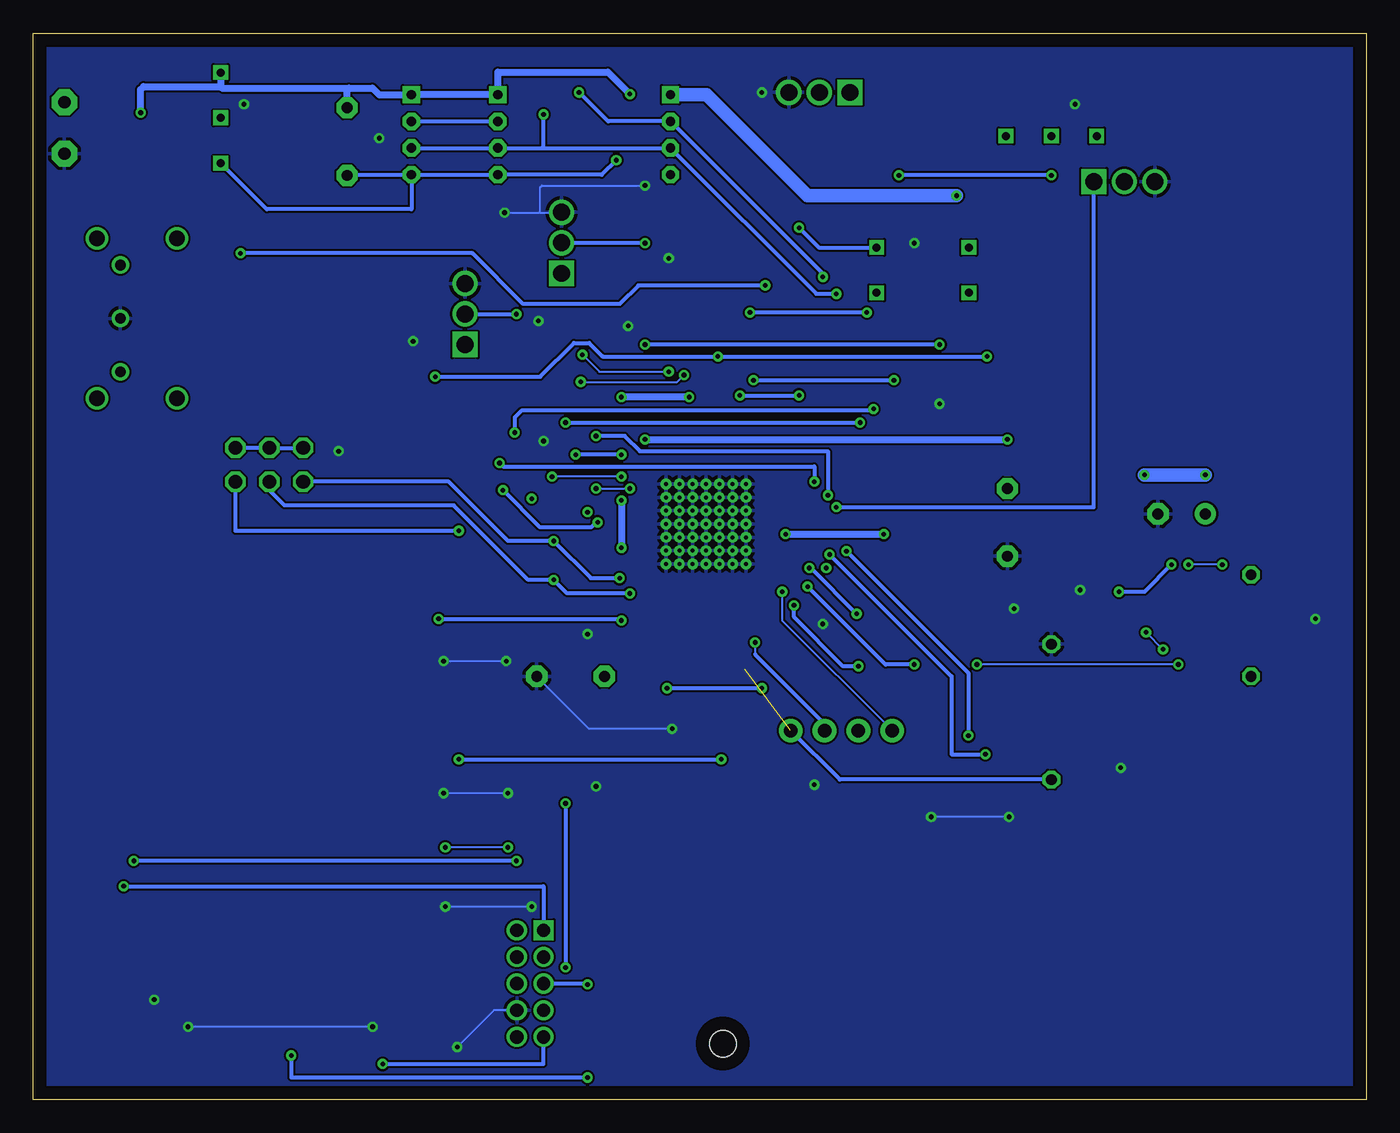
[diagram p3: board, bottom side, seen from below]

Size 100 x 80 mm. Coordinates in mm from the lower left corner, seen from the top.
Outline: 0,0 100,0 100,80 0,80 0,0
Copper layers (1*16): Top 0.035mm / dielectric 1.5mm / Bottom 0.035mm
Design rules "default": minimum track width 6mil, minimum drill 0.35mm, track to track 6mil, track to pad 6mil, pad to pad 6mil, via to via 6mil, smd to smd 6mil, copper to edge 40mil, drill to drill 6mil, minimum pad ring 10mil, minimum via ring 8mil, stop-mask expansion 4mil, vias tented up to drill 0mil, thermal gap 10mil

### Footprints (pad centres in the part's own frame; a part is rotated, then mirrored left to right if it is on the bottom)
CC-14-1 = smd 1.145 x 0.55: 1 -1.097,2; 2 -1.097,1.2; 3 -1.097,0.4; 4 -1.097,-0.4; 5 -1.097,-1.2; 6 -1.097,-2; 8 1.097,-2; 9 1.097,-1.2; 10 1.097,-0.4; 11 1.097,0.4; 12 1.097,1.2; 13 1.097,2 | smd 0.55 x 1.145: 7 0,-2.098; 14 0,2.098
BATTERY_BR1225/FA = drill 0.914 pad 1.93 octagon: + -1.925,1.4; - 1.925,1.4
12BH23PGR = smd 5.35 x 7.35: 1 -23.95,0; 2 23.95,0 | hole 2: -18.9,8.2
C1808 = smd 1.6 x 2.2: 1 -1.95,0; 2 1.95,0
C5B3.5 = drill 0.813 pad 1.6 octagon: 1 -2.54,0; 2 2.54,0
E3,5-8 = drill 0.813 pad 1.6: + -1.778,0 | drill 0.813 pad 1.6 octagon: - 1.778,0
1X04-BIG = drill 1.016 pad 1.778: 1 0,0; 2 2.54,0; 3 5.08,0; 4 7.62,0
SOT132P220X110-3N = smd 1.1 x 0.4: 1 -1,1.32; 2 -1,-1.32; 3 1,0
SHDR10W55P200_2X5_1265X630X640 = drill 1 pad 1.5 square: 1 0,0 | drill 1 pad 1.5: 2 0,2; 3 2,0; 4 2,2; 5 4,0; 6 4,2; 7 6,0; 8 6,2; 9 8,0; 10 8,2
S-PWSON-N10 = smd 0.28 x 0.85: 1 -1,-1.475; 2 -0.5,-1.475; 3 0,-1.475; 4 0.5,-1.475; 5 1,-1.475; 6 1,1.475; 7 0.5,1.475; 8 0,1.475; 9 -0.5,1.475; 10 -1,1.475 | smd 3.55 x 1.7: PAD 0,0
SOIC127P600X175-8N = smd 1.525 x 0.7: 1 -2.712,1.905; 2 -2.712,0.635; 3 -2.712,-0.635; 4 -2.712,-1.905; 5 2.712,-1.905; 6 2.712,-0.635; 7 2.712,0.635; 8 2.712,1.905
2X03/90 = drill 1.016 octagon: 1 -2.54,-6.35; 2 -2.54,-3.81; 3 0,-6.35; 4 0,-3.81; 5 2.54,-6.35; 6 2.54,-3.81
R0201 = smd 0.28 x 0.43: 1 -0.255,0; 2 0.255,0
0204/7 = drill 0.813 octagon: 1 -3.81,0; 2 3.81,0
L3216C = smd 1.2 x 1.6: 1 -1.5,0; 2 1.5,0
LEDM3216X130N = smd 1.3 x 1.45: 1 -1.55,0; 2 1.55,0
FSMSM = smd 2.27 x 1.6: 1 -4.55,0; 2 4.55,0
TO229P250X658X985-3P = drill 1.27 pad 1.905 square: 1 0,0 | drill 1.27 pad 1.905: 2 2.29,0; 3 4.58,0
SC70-3_DCK = smd 0.4 x 0.9: 1 0.65,1.1; 2 -0.65,1.1; 3 0,-1.1
0207/10 = drill 0.813 octagon: 1 -5.08,0; 2 5.08,0
RES_1206 = smd 1.08 x 1.68: 1 -1.445,0; 2 1.445,0
R5025 = smd 1.8 x 2.7: 1 -2.2,0; 2 2.2,0
R1206 = smd 1.6 x 1.803: 1 -1.422,0; 2 1.422,0
EG1224 = drill 0.8 pad 1.3: 1 0,0; 2 4,0; 3 8,0 | drill 1.14 pad 1.71: MH1 -2,-4.25; MH2 -2,1.75; MH3 10,1.75; MH4 10,-4.25
RGC0064A = smd 0.9 x 0.3: 1 -4.5,3.75; 2 -4.5,3.25; 3 -4.5,2.75; 4 -4.5,2.25; 5 -4.5,1.75; 6 -4.5,1.25; 7 -4.5,0.75; 8 -4.5,0.25; 9 -4.5,-0.25; 10 -4.5,-0.75; 11 -4.5,-1.25; 12 -4.5,-1.75; 13 -4.5,-2.25; 14 -4.5,-2.75; 15 -4.5,-3.25; 16 -4.5,-3.75; 33 4.5,-3.75; 34 4.5,-3.25; 35 4.5,-2.75; 36 4.5,-2.25; 37 4.5,-1.75; 38 4.5,-1.25; 39 4.5,-0.75; 40 4.5,-0.25; 41 4.5,0.25; 42 4.5,0.75; 43 4.5,1.25; 44 4.5,1.75; 45 4.5,2.25; 46 4.5,2.75; 47 4.5,3.25; 48 4.5,3.75 | smd 0.3 x 0.9: 17 -3.75,-4.5; 18 -3.25,-4.5; 19 -2.75,-4.5; 20 -2.25,-4.5; 21 -1.75,-4.5; 22 -1.25,-4.5; 23 -0.75,-4.5; 24 -0.25,-4.5; 25 0.25,-4.5; 26 0.75,-4.5; 27 1.25,-4.5; 28 1.75,-4.5; 29 2.25,-4.5; 30 2.75,-4.5; 31 3.25,-4.5; 32 3.75,-4.5; 49 3.75,4.5; 50 3.25,4.5; 51 2.75,4.5; 52 2.25,4.5; 53 1.75,4.5; 54 1.25,4.5; 55 0.75,4.5; 56 0.25,4.5; 57 -0.25,4.5; 58 -0.75,4.5; 59 -1.25,4.5; 60 -1.75,4.5; 61 -2.25,4.5; 62 -2.75,4.5; 63 -3.25,4.5; 64 -3.75,4.5 | smd 7.25 x 7.25: 65 0,0 | drill 0.3: V 3,3; V_1 3,1; V_2 -3,2; V_3 -3,0; V_4 -2,2; V_5 -3,3; V_6 -3,1; V_7 -2,3; V_8 -3,-3; V_9 -2,1; V_10 -3,-2; V_11 -3,-1; V_12 2,2; V_13 3,2; V_14 2,1; V_15 -1,1; V_16 0,1; V_17 1,1; V_18 1,3; V_19 -1,3; V_20 0,3; V_21 2,3; V_22 1,2; V_23 -1,2; V_24 0,2; V_25 -2,0; V_26 -1,0; V_27 0,0; V_28 1,0; V_29 2,0; V_30 3,0; V_31 -2,-1; V_32 -2,-2; V_33 -2,-3; V_34 -1,-1; V_35 -1,-2; V_36 -1,-3; V_37 0,-1; V_38 0,-2; V_39 0,-3; V_40 1,-1; V_41 1,-2; V_42 1,-3; V_43 2,-1; V_44 2,-2; V_45 2,-3; V_46 3,-1; V_47 3,-2; V_48 3,-3
LTP5902-MMCX = smd 0.7 x 1.8: M1 -5.4,18.6; M2 -4.4,18.6; M3 4.1,18.6; M4 5.1,18.6; P31 -6.607,-19.043; P32 -5.607,-19.043; P33 -4.607,-19.043; P34 4.893,-19.043; P35 5.893,-19.043; P36 6.893,-19.043 | smd 1.8 x 0.7: P1 -11.9,10.6; P2 -11.9,9.6; P3 -11.9,8.6; P4 -11.9,7.6; P5 -11.9,6.6; P6 -11.9,5.6; P7 -11.9,4.6; P8 -11.9,3.6; P9 -11.9,2.6; P10 -11.9,1.6; P11 -11.9,0.6; P12 -11.9,-0.4; P13 -11.9,-1.4; P14 -11.9,-2.4; P15 -11.9,-3.4; P16 -11.9,-4.4; P17 -11.9,-5.4; P18 -11.9,-6.4; P19 -11.9,-7.4; P20 -11.9,-8.4; P21 -11.9,-9.4; P22 -11.9,-10.4; P23 -11.9,-11.4; P24 -11.9,-12.4; P25 -11.9,-13.4; P26 -11.9,-14.4; P27 -11.9,-15.4; P28 -11.9,-16.4; P29 -11.9,-17.4; P30 -11.9,-18.4; P37 12.1,-18.4; P38 12.1,-17.4; P39 12.1,-16.4; P40 12.1,-15.4; P41 12.1,-14.4; P42 12.1,-13.4; P43 12.1,-12.4; P44 12.1,-11.4; P45 12.1,-10.4; P46 12.1,-9.4; P47 12.1,-8.4; P48 12.1,-7.4; P49 12.1,-6.4; P50 12.1,-5.4; P51 12.1,-4.4; P52 12.1,-3.4; P53 12.1,-2.4; P54 12.1,-1.4; P55 12.1,-0.4; P56 12.1,0.6; P57 12.1,1.6; P58 12.1,2.6; P59 12.1,3.6; P60 12.1,4.6; P61 12.1,5.6; P62 12.1,6.6; P63 12.1,7.6; P64 12.1,8.6; P65 12.1,9.6; P66 12.1,10.6
WIND = drill 0.6 square: P$1 -3.458,1.827; P$2 -3.458,-1.573; P$3 3.458,1.827; P$4 3.458,-1.573
SEN0219 = drill 0.6 square: P$1 3.4,3.4; P$2 3.4,0; P$3 3.4,-3.4
LM393 = drill 0.6 square: P$1 3.4,3.4; P$2 3.4,0; P$3 3.4,-3.4
B4B-PH-K-S = drill 0.7 pad 1.3 square: 1 3,0 | drill 0.7 pad 1.3 octagon: 2 1,0; 3 -1,0; 4 -3,0
7.0X5.0 = smd 2.2 x 1.4: 1 -3.2,-1.25; 2 3.2,-1.25; 3 3.2,1.25; 4 -3.2,1.25

### Placement (x,y rotation side)
AC1  59.05,71.88 0 top
BATT_1  96.27,72.9 270 top
BATT_2  29.37,12.39 180 top
C1  14.61,28.07 0 top
C2  14.5,30.86 0 top
C3  26.92,43.31 270 top
C4  54.48,52.96 90 top
C5  50.16,25.27 270 top
C6  18.59,34.72 270 top
C7  2.54,41.27 270 top
C8  13.84,43.94 0 top
C9  23.62,38.61 270 top
C10  62.74,53.34 0 top
C11  62.74,56.39 0 top
C12  30.35,38.99 180 top
C13  59.69,31.75 180 top
C14  94.11,43.69 0 top
C15  76.45,71.88 270 top
C16  36.32,45.97 90 top
C17  33.66,45.97 90 top
C18  30.99,45.97 90 top
C19  52.2,35.43 0 top
C20  52.2,32.64 0 top
C21  52.2,29.84 0 top
C22  41.78,30.86 180 top
CN1  35.56,27.69 0 top
D1  95.89,48.64 90 top
HDR1  61.72,12.7 270 top
IC1  13.34,35.69 0 top
IC2  30.48,32.51 270 top
JP1  82.3,42.55 180 top
JP2  57.78,44.83 270 top
JP3  62.36,46.74 0 top
L1  8.64,35.56 270 top
L2  57.78,40.26 90 top
L3  69.85,50.67 270 top
LED1  74.68,61.34 0 top
PB1  73.66,49.66 90 top
Q1  67.61,56.65 90 top
Q2  60.37,61.99 90 top
Q3  20.43,68.87 180 top
Q4  38.73,75.56 0 top
Q5  61.47,18.92 90 top
R1  23.62,29.08 270 top
R2  90.68,47.88 0 top
R3  19.91,42.7 90 top
R4  5.33,41.4 90 top
R5  6.22,46.61 0 top
R6  31.24,23.88 0 top
R7  26.8,25.02 270 top
R8  35.94,32.51 270 top
R9  54.36,25.4 270 top
R10  74.68,58.93 0 top
R11  63.88,37.59 0 top
R12  63.75,40.51 0 top
R13  46.61,25.27 90 top
S1  93.47,62.61 270 top
U2  49.53,43.18 0 top
U3  83.57,22.35 0 top
U4  33.27,62.1 0 top
U5  23.62,75.69 270 top
U6  82.55,73.66 0 top
X1  71.63,72.39 90 top
X2  65.15,72.39 90 top
X3  52.2,72.39 90 top
Y1  49.24,62.52 270 top

### Tracks (layer width: path | path; a pad name or v marks a point on that pad's centre or on a via)
+3.3V  (via drill 0.35)
  Top 0.152: v43.56,42.42 44.32,42.42 44.34,42.43 U2.10 | 50.78,52.69 v50.8,52.7 | U2.44 55.85,44.93 v55.88,44.96 | U2.37 55.85,41.43 v55.88,41.4 | 93.47,21.97 93.49,21.95 | R10.1 73.66,58.5 PB1.2
  Top 0.305: U2.54 50.78,52.69 | IC2.7 IC2.8 | IC2.3 29.84,36.96 31.88,38.99 C12.1 | 55.24,73.91 57.92,73.91 AC1.1
  Top 0.508: v55.24,75.44 55.24,73.91 55.24,68.2 56.77,66.67 56.77,52.7 | 91.95,54.23 91.95,50.29 93.47,48.77 93.47,47.62 | 93.47,43.69 93.47,47.62 | 93.47,43.69 93.47,21.97 | v91.95,74.04 91.95,62.61 | 91.95,62.61 91.95,54.23 | v55.88,52.7 56.77,52.7 | v55.88,44.96 56.77,44.96 56.77,49.53 | 93.49,21.95 U3.P55 | 93.47,43.69 C14.1 | PB1.2 83.42,54.23 91.95,54.23 | IC2.8 35.86,29.8 35.94,29.88 R8.2 | 56.77,49.53 56.77,52.7 | IC2.3 29.84,33.66 28.19,33.66 28.19,31.5 31.11,31.5 IC2.7 | D1.1 93.49,47.64 93.47,47.62 | BATT_1.+ 93.47,70.63 S1.1 91.95,62.61 | v26.92,49.53 C3.1 26.92,42.42 32.38,42.42 | 32.38,42.42 v36.2,42.42 | C12.1 32.3,42.34 32.38,42.42 | v54.1,49.53 56.77,49.53 | 93.47,47.62 92.46,47.62 92.2,47.37 92.12,47.45 R2.2
  Bottom 0.508: v55.24,75.44 56.9,77.09 65.15,77.09 X2.1 X1.1 74.04,75.39 74.55,75.9 76.33,75.9 | v50.8,52.7 v55.88,52.7 | v55.88,44.96 v55.88,41.4 | 76.33,75.9 85.85,75.9 85.95,76 | C15.1 76.45,75.77 76.33,75.9 | v43.56,42.42 v36.2,42.42 | v91.95,74.04 91.95,75.77 91.72,76 85.95,76 | U6.P$1 85.95,76 | v54.1,49.53 v26.92,49.53
+3.6V
  Top 0.152: IC1.2 12.84,33.15
  Top 0.508: 12.84,33.15 12.84,31.14 C2.1 | C1.1 12.55,28.17 12.55,28.32 12.68,28.19
  Top 1.016: BATT_2.2 12.52,12.39 12.68,12.55 12.68,28.19 | C2.1 12.55,28.32
+5V  (via drill 0.35)
  Top 0.152: IC1.9 12.84,38.09
  Top 0.305: 12.84,38.09 12.84,38.22 12.19,38.86
  Top 0.508: 12.19,38.86 12.13,38.92 12.13,40.96
  Top 1.016: 27.02,63.8 23.62,60.4 23.62,46.48 | 23.62,46.48 C9.1 | U5.P$1 27.02,67.56 | 27.02,67.56 27.02,63.8 | 12.13,40.96 10.73,42.35 | 10.73,42.35 12.06,43.69 C8.+ | R3.2 19.68,45.13 19.68,46.74 19.81,46.86 | v12.06,46.86 8.68,46.86 R5.2 8.42,44.66 10.73,42.35 | v16.64,46.86 19.81,46.86 | 19.81,46.86 23.24,46.86 23.62,46.48 | v30.73,67.82 27.28,67.82 27.02,67.56 | 27.02,63.8 27.15,63.93 U4.P$1
  Bottom 1.016: X3.1 49.48,75.39 41.91,67.82 v30.73,67.82 | v12.06,46.86 v16.64,46.86
DC_ANA2  (via drill 0.35)
  Top 0.152: v57.78,45.85 JP2.1 | U2.46 55.16,45.93 v55.24,45.85
  Bottom 0.152: v57.78,45.85 v55.24,45.85
DC_DIGSW  (via drill 0.35)
  Top 0.152: U2.43 55.27,44.43 56.39,43.31 | v64.77,45.72 68.22,49.17 L3.2
  Top 0.305: 56.39,43.31 v57.66,43.31
  Bottom 0.305: v57.66,43.31 57.78,43.31 58.17,42.93 61.98,42.93 v64.77,45.72
FB_TPS  (via drill 0.35)
  Top 0.152: 4.06,42.82 R4.2 5.29,42.9 8.03,42.9 v10.79,40.13 | 4.06,42.82 2.94,42.82 C7.1 | v13.34,40.13 IC1.8 | 4.06,42.82 4.02,42.87 R5.1
  Bottom 0.152: v10.79,40.13 v13.34,40.13
FLASH_P_ENN  (via drill 0.35)
  Top 0.305: v92.46,17.91 92.5,17.95 U3.P51 | v63.75,17.91 63.72,17.88 HDR1.2
  Bottom 0.305: v63.75,17.91 v92.46,17.91
FLS_SPI_CLK  (via drill 0.35)
  Top 0.152: v38.99,41.15 39.62,41.78 44.2,41.78 44.34,41.93 U2.11
  Top 0.305: IC2.6 v29.84,27.3 29.82,27.28 R6.1
  Bottom 0.305: v29.84,27.3 29.84,32 v38.99,41.15
FLS_SPI_CS  (via drill 0.35)
  Top 0.152: v41.78,39.88 42.34,40.43 U2.14
  Top 0.305: R8.1 35.94,35.43 | 35.94,35.43 36.96,36.45 v38.23,36.45 | 35.94,35.43 32.59,35.43 IC2.1
  Bottom 0.305: v41.78,39.88 41.66,39.88 v38.23,36.45
FLS_SPI_DIN  (via drill 0.35)
  Top 0.152: v40.51,39.88 41.56,40.93 U2.13
  Top 0.305: IC2.2 31.11,36.07 32.26,37.21 37.85,37.21 v40.51,39.88
FLS_SPI_DOUT  (via drill 0.35)
  Top 0.152: v40.26,40.89 40.8,41.43 U2.12
  Top 0.305: v28.57,25.91 28.57,26.67 | 28.57,26.67 IC2.5 | R7.1 27.03,26.67 28.57,26.67
  Bottom 0.305: v28.57,25.91 31.11,25.91 31.11,31.75 v40.26,40.89
GND  (via drill 0.35)
  Top 0.152: IC1.4 13.84,34.92 13.97,35.05 IC1.PAD | IC1.7 13.84,36.46 13.97,36.32 IC1.PAD | IC1.PAD 14.61,35.69 16.51,33.78 16.51,32.89 | IC1.PAD 13.97,35.69 15.62,37.34 15.62,41.91 13.97,41.91 13.97,43.94 | C6.2 18.59,32.51 18.82,32.74 | C9.2 22.74,36.66 18.82,32.74 | 18.82,32.74 18.54,32.74 18.39,32.89 16.51,32.89 | U3.P42 97.6,8.95 97.66,8.89 | 97.66,8.89 97.66,3.81 95.81,3.81 U3.P37 92.95,3.95 91.44,5.46 v88.39,5.46 88.46,5.39 U3.P34 | U3.P49 97.46,15.95 97.66,15.75 | 97.66,8.89 97.66,15.75 | 97.66,15.75 97.66,22.99 | 97.66,22.99 97.66,33.02 | 97.66,43.69 97.66,33.02 | 97.66,33.02 97.59,32.95 U3.P66 | v74.55,5.46 73.03,3.94 73.01,3.95 U3.P30 69.09,3.95 | 71.75,32.95 U3.P1 69.27,32.95 v69.22,32.89 | IC1.PAD 9.63,35.69 R4.1 3.19,39.98 C7.2 | BATT_2.1 51.94,13.77 51.94,21.21 | 51.94,21.21 51.94,23.5 | 51.94,23.5 51.94,26.8 | 51.94,26.8 51.94,27.69 v52.07,27.81 54.1,29.84 C21.2 C20.2 C19.2 | C11.2 64.69,61.21 64.77,61.21 | 64.77,61.21 67.64,61.21 Q1.3 | C14.2 97.66,43.69 | U3.P20 69.09,13.95 | R9.1 52.03,26.84 51.94,26.8 | 97.66,43.69 97.66,47.64 | C9.2 23.62,38.35 23.75,38.48 26.92,38.48 | C9.2 R1.1 25.02,34.16 25.02,23.88 25.3,23.6 R7.2 v26.8,21.21 | 32.64,23.85 v32.64,21.21 51.94,21.21 | 28.4,35.4 C12.2 28.4,38.48 26.92,38.48 | D1.2 97.66,47.64 | 64.77,61.21 64.64,61.34 v64.64,66.55 | C8.- 13.97,43.94 | 13.97,43.94 13.97,64.9 15.88,66.8 15.88,68.85 Q3.3 | Q4.3 43.31,77.35 43.43,77.47 53.98,77.47 54.1,77.34 v54.1,68.58 | U3.P56 97.63,22.95 97.66,22.99 | 97.66,47.64 97.66,58.67 97.6,58.61 | S1.2 97.6,58.61 | v64.52,32.89 63.37,31.75 C13.1 60.96,31.75 60.96,23.45 61.42,22.99 | 61.42,22.99 v64.39,22.99 | 69.09,3.95 69.09,13.95
  Top 0.152: 61.42,18.24 61.38,18.27 Q5.2 | 69.09,13.95 v69.09,14.48 | 61.42,18.24 61.42,22.99 | 61.42,18.24 61.42,15.67 v62.61,14.48 | v68.2,3.94 68.21,3.95 69.09,3.95 | C3.2 26.92,38.48 | 51.94,23.5 51.1,23.5 C5.2 49.66,23.83 R13.1 | U3.P11 69.25,22.95 v69.22,22.99 | 97.6,58.61 97.6,70.91 BATT_1.- | C1.2 16.55,30.76 C2.2 16.51,30.92 16.51,32.89 | R11.2 65.3,40.39 R12.2
  Top 0.305: 32.64,23.85 R6.2 | IC2.4 28.4,35.4 | C16.2 C17.2 C18.2
  Bottom 0.152: v74.55,5.46 v88.39,5.46 | v26.8,21.21 v32.64,21.21 | v64.64,66.55 61.98,66.55 | 61.98,66.55 60.39,66.55 Q2.3 | 61.98,66.55 61.98,68.45 61.85,68.58 v54.1,68.58 | v69.22,32.89 v64.52,32.89 | v64.39,22.99 v69.22,22.99 | C13.1 58.29,27.81 v52.07,27.81 | v69.09,14.48 v62.61,14.48 | HDR1.8 65.44,6.7 v68.2,3.94
  other vias: 21.84,74.68 45.34,75.56 52.32,63.12 74.04,72.14 84.2,74.68 71.5,56.9 77.09,48.64 90.93,7.49 57.78,23.5 41.4,23.62 18.41,24.89 3.81,36.07 21.46,38.23 26.42,36.83 32,52.2 61.72,49.4 58.42,34.92 40.77,35.69 33.91,64.26 62.1,58.42 55.37,58.04
  pour Bottom: 0,-0.13 0,80.01 100.2,80.01 100.2,-0.13
  pour Top: 0,-0.13 0,80.01 100.33,80.01 100.33,-0.13
GPIO2  (via drill 0.35)
  Top 0.152: 48.01,50.42 49.28,49.15 U2.57
  Top 0.305: v37.47,59.05 36.7,59.82 36.7,60.5 U4.P$4 | v46.23,59.05 46.23,56.26 48.01,54.48 48.01,50.42
  Bottom 0.305: v37.47,59.05 v46.23,59.05
GPIO3  (via drill 0.35)
  Top 0.152: U2.58 48.77,47.69 48.77,48.9 46.99,50.67
  Top 0.305: v42.55,65.41 v42.55,52.83 | v46.99,52.83 46.99,50.67
  Bottom 0.305: v42.55,65.41 41.07,63.93 U4.P$3 | v46.99,52.83 v42.55,52.83
GPIO4  (via drill 0.35)
  Top 0.152: 45.97,50.8 48.26,48.51 48.26,47.7 U2.59
  Top 0.305: U5.P$2 v23.62,69.34 | v35.05,69.34 35.43,68.96 v35.43,53.98 | 45.97,50.8 v45.97,53.98
  Bottom 0.305: v23.62,69.34 v35.05,69.34 | v45.97,53.98 v35.43,53.98
GPIO5  (via drill 0.35)
  Top 0.152: U2.60 47.78,48.36 45.47,50.67
  Top 0.305: 45.47,50.67 45.09,51.05 v45.09,61.09 | v84.45,63.5 84.45,72.17 U6.P$2
  Bottom 0.305: v45.09,61.09 54.61,61.09 56.01,59.69 63.25,59.69 67.06,63.5 v84.45,63.5
GPIO12
  Top 0.152: U2.3 43.86,45.93 43.81,45.97
  Top 0.305: Q4.1 38.73,50.55 40.51,48.77 43.31,45.97 43.81,45.97
GPIO13  (via drill 0.35)
  Top 0.152: U2.4 41.4,45.43 v41.4,46.35
  Top 0.305: v65.02,47.75 65.02,50.42 67.61,53.01 Q1.1
  Bottom 0.305: v65.02,47.75 64.77,47.5 41.4,47.5 v41.4,46.35
GPIO14  (via drill 0.35)
  Top 0.152: U2.5 40.39,44.93 v40.39,45.34
  Top 0.305: Q2.1 57.78,61.88 v57.78,49.79 v57.78,49.78
  Bottom 0.305: v57.78,49.78 55.63,49.78 54.48,48.64 40.39,48.64 v40.39,45.34
GPIO15  (via drill 0.35)
  Top 0.152: U2.6 39.77,44.43 v39.75,44.45
  Bottom 0.305: v39.75,44.45 20.43,44.45 Q3.1
GPIO22  (via drill 0.35)
  Top 0.152: IC1.3 13.34,33.4 v14.1,32.64 | v41.91,38.48 43.36,39.93 U2.15
  Top 0.305: v29.21,32.64 v33.91,32.64
  Bottom 0.152: v14.1,32.64 v29.21,32.64
  Bottom 0.305: v33.91,32.64 36.07,32.64 v41.91,38.48
GPIO31  (via drill 0.35)
  Top 0.305: v58.42,44.07 58.36,44.01 JP2.2
IPCS_MISO  (via drill 0.35)
  Top 0.305: v80.64,3.3 U3.P33 | v58.42,1.65 v58.42,8.64
  Bottom 0.305: v80.64,3.3 80.64,1.65 v58.42,1.65 | v58.42,8.64 58.48,8.7 HDR1.5
IPCS_SSN  (via drill 0.35)
  Top 0.305: U3.P39 93.36,5.95 93.22,6.1 v93.22,16
  Bottom 0.305: v93.22,16 61.72,16 HDR1.1
JP1_PWR
  Top 0.305: R2.1 85.85,47.88 JP1.1
  Bottom 0.305: JP1.1 JP1.3 JP1.5
L2_ANA
  Top 0.152: U2.38 55.27,41.93 55.63,42.29 57.25,42.29 L2.2
L_TPS1
  Top 0.152: IC1.1 11.1,34.21 L1.2
L_TPS2
  Top 0.152: IC1.10 9.92,39.58 8.84,39.58 L1.1
LED1
  Top 0.152: R10.2 76.12,61.24 LED1.2
PG_TPS  (via drill 0.35)
  Top 0.152: v15.24,33.78 14.81,34.21 IC1.5 | v16.51,35.05 16.64,35.18 16.64,37.86 19.28,40.5 R3.1
  Bottom 0.152: v16.51,35.05 v15.24,33.78
Q1+  (via drill 0.35)
  Top 0.152: 56.28,71.48 56.26,71.5
  Top 0.305: AC1.5 56.9,70.68 56.9,71.48 | v56.26,70.48 56.26,71.5 56.26,72.01 57.33,73.08 AC1.2 | AC1.4 56.9,71.48 | 56.9,71.48 56.28,71.48 | X2.4 63.75,67.99 v63.75,58.93
  Bottom 0.305: X1.4 X2.4 57.36,69.39 v56.26,70.48 | X1.4 71.63,66.8 82.49,66.8 U6.P$3 | Q1.2 63.77,58.94 v63.75,58.93 | X1.4 71.68,69.34 C15.2
Q2+  (via drill 0.35)
  Top 0.305: U4.P$2 32,60.53 v32,56.64 | v54.1,56.64 v54.1,64.26
  Bottom 0.305: v32,56.64 v54.1,56.64 | v54.1,64.26 60.35,64.26 Q2.2
Q3+
  Top 0.305: U5.P$3 20.19,72.26 18.14,72.26 Q3.2
Q4+
  Top 0.305: Q4.2 41.15,75.44 41.15,73.79 45.55,69.39 X3.4
RESETN  (via drill 0.35)
  Top 0.152: Q5.3 62.6,18.95 64.36,18.95 v64.39,18.92 | v69.09,18.92 69.12,18.95 71.88,18.95
  Top 0.305: U3.P15 71.88,18.95 | HDR1.6 63.79,8.64 65.15,8.64 65.15,18.16 v64.39,18.92
  Bottom 0.152: v64.39,18.92 v69.09,18.92
RST_BTN  (via drill 0.35)
  Top 0.305: Q5.1 59.61,19.57 55.88,23.3 55.88,23.95 | R9.2 55.88,23.95 | 56.01,31.75 55.88,31.62 55.88,23.95 | C13.2 56.01,31.75 | 56.01,31.75 55.88,31.88 v55.88,35.94 | PB1.1 71.78,45.11 69.6,42.93 v69.6,36.07
  Bottom 0.305: v69.6,36.07 56.01,36.07 v55.88,35.94
SCL  (via drill 0.35)
  Top 0.152: 41.98,49.98 41.97,49.98
  Top 0.305: v40.77,61.72 40.77,51.18 41.97,49.98 | AC1.14 59.05,74.8 | X2.2 64.01,73.39 62.59,74.8 59.05,74.8 | 41.98,49.98 U2.1 | 59.05,74.8 v59.05,75.56
  Bottom 0.152: 40.77,61.96 v40.77,61.72
  Bottom 0.305: X1.2 X2.2 | 40.77,61.96 X3.2 56.88,73.39 v59.05,75.56
SDA  (via drill 0.35)
  Top 0.152: 44.25,46.43 U2.2
  Top 0.305: v39.75,60.45 39.75,50.93 44.25,46.43 | v61.72,73.91 61.69,73.88 AC1.13
  Bottom 0.305: X1.3 X2.3 61.85,71.39 | v39.75,60.45 41.26,60.45 X3.3 61.85,71.39 | 61.85,71.39 61.72,71.52 v61.72,73.91
SOP0  (via drill 0.35)
  Top 0.152: U2.35 55.07,40.43 56.01,39.5 v56.01,39.12
  Top 0.305: R12.1 60.96,41.88 v60.96,41.91
  Bottom 0.305: v56.01,39.12 58.17,39.12 v60.96,41.91 64.39,41.91 68.83,46.35 JP1.6
SOP1  (via drill 0.35)
  Top 0.152: U2.34 54.81,39.93 55.24,39.5 v55.24,37.97
  Top 0.305: R11.1 60.96,37.59 v60.96,38.99
  Bottom 0.305: v55.24,37.97 59.94,37.97 v60.96,38.99 62.87,38.99 68.45,44.58 81.15,44.58 82.3,45.72 JP1.4
SOP2  (via drill 0.35)
  Top 0.152: U2.21 47.78,34.19
  Top 0.305: 47.78,34.19 47.78,28.35 46.61,27.18 R13.2 47.8,25.53 v48.39,25.53 | v68.07,25.53 v68.07,42.67
  Bottom 0.305: v68.07,25.53 v48.39,25.53 | v68.07,42.67 84.84,42.67 JP1.2
TCK  (1 unrouted)
  Top 0.152: U2.19 46.78,37.13 46.23,36.58
  Top 0.305: 46.61,32.26 44.58,34.29 44.58,34.92 46.23,36.58
  Bottom 0.305: R1.2 39.5,24 CN1.4
TDI  (via drill 0.35)
  Top 0.152: 42.93,38.48 43.88,39.43 U2.16
  Top 0.305: v38.1,32.51 CN1.2 | 42.93,38.48 v42.93,37.08
  Bottom 0.305: v38.1,32.51 39.24,32.51 42.93,36.2 v42.93,37.08
TDO  (via drill 0.35)
  Top 0.152: v43.81,38.1 44.4,38.68 U2.17
  Bottom 0.152: v43.81,38.1 43.81,35.94 CN1.1
TMS  (via drill 0.35)
  Top 0.152: U2.20 47.28,35.72
  Top 0.305: 47.28,35.72 v45.85,34.29
  Bottom 0.152: v45.85,34.29 45.85,33.4
  Bottom 0.305: CN1.3 40.64,28.19 45.85,33.4
UARTC0_RX  (via drill 0.35)
  Top 0.152: 41.02,43.43 U2.8
  Top 0.305: v36.96,51.82 36.96,50.42 38.23,49.15 38.23,43.69 38.99,42.93 40.51,42.93 41.02,43.43 | U3.P32 77.98,3.29 77.98,1.65 66.77,1.65 HDR1.10 66.17,4.7 66.17,33.91 63.88,36.2 v63.88,50.04
  Bottom 0.305: v36.96,51.82 37.08,51.69 63.37,51.69 63.88,51.18 v63.88,50.04
UARTC0_TX  (via drill 0.35)
  Top 0.152: 40.51,43.94 45.02,43.94
  Top 0.305: v37.97,50.8 37.97,50.16 38.86,49.28 38.86,44.07 39.37,43.56 40.13,43.56 40.51,43.94 | 45.02,43.94 U2.7 | U3.P31 76.83,3.17 74.3,3.17 v73.79,2.67 | v60.07,50.8 v60.07,22.23 | v60.07,9.91 60.07,4.7 HDR1.9
  Bottom 0.305: v60.07,50.8 v37.97,50.8 | v73.79,2.67 61.72,2.67 HDR1.9 | v60.07,22.23 v60.07,9.91
VAUX_TPS  (via drill 0.35)
  Top 0.152: IC1.6 14.34,39.86 v14.61,40.13
  Top 0.305: v18.54,38.1 18.59,38.05 C6.1
  Bottom 0.305: v14.61,40.13 16.64,38.1 v18.54,38.1
VCC_DCDC  (via drill 0.35)
  Top 0.152: JP3.2 v62.61,45.09
VDD_ANA1  (via drill 0.35)
  Top 0.152: 51.44,29.84 C21.1 | U2.25 49.78,36.83 50.25,36.37 C19.1 | U2.36 55.21,40.93 57.15,38.99 57.55,38.99 57.73,38.81 L2.1 | U2.48 54.42,46.93 v55.88,48.39
  Top 0.305: v52.45,30.86 51.44,29.84 | C21.1 C20.1 C19.1 51.9,37.08 57.78,37.08 L2.1 | C22.1 v45.34,30.86 | v59.31,48.39 59.31,40.38 57.74,38.81 57.73,38.81
  Bottom 0.305: v45.34,30.86 v52.45,30.86 | v55.88,48.39 v59.31,48.39
VDD_ANA2  (via drill 0.35)
  Top 0.152: U2.47 54.81,46.43 55.12,46.74 v55.88,46.74 | v61.09,46.74 JP3.1
  Bottom 0.152: v55.88,46.74 v61.09,46.74
VDD_DIG  (via drill 0.35)
  Top 0.152: U2.9 44.32,42.93 44.2,43.05 41.53,43.05 40.77,42.29 | U2.56 49.78,49.28 48.64,50.42
  Top 0.305: 40.77,42.29 38.05,42.29 C16.1 C17.1 C18.1 28.49,44.02 28.45,44.07 v28.45,55.75 | 48.64,50.42 v48.64,55.75 | L3.1 v69.85,54.23
  Bottom 0.305: v28.45,55.75 v48.64,55.75 57.28,55.75 58.29,56.77 59.44,56.77 61.98,54.23 v69.85,54.23
VDD_PULL
  Top 0.152: U2.24 49.28,37.79 48.77,37.28 48.77,27.16 48.87,27.22 C5.1
VDD_RAM
  Top 0.305: U2.49 53.28,49.98 54.31,51.01 C4.1
XTAL1  (via drill 0.35)
  Top 0.152: v58.8,55.88 60.28,55.88 C11.1 | Y1.3 52.18,59.32 52.32,59.18 v52.32,54.61 52.32,47.72 U2.51
  Bottom 0.152: v52.32,54.61 57.53,54.61 v58.8,55.88
XTAL2  (via drill 0.35)
  Top 0.152: Y1.1 47.99,62.37 49.15,61.21 49.15,56.39 v51.18,54.36 51.78,53.76 U2.52 | v58.93,53.85 59.44,53.34 C10.1
  Bottom 0.152: v58.93,53.85 51.69,53.85 v51.18,54.36